# EAGLE schematic relay_board (EAGLE 6.4)
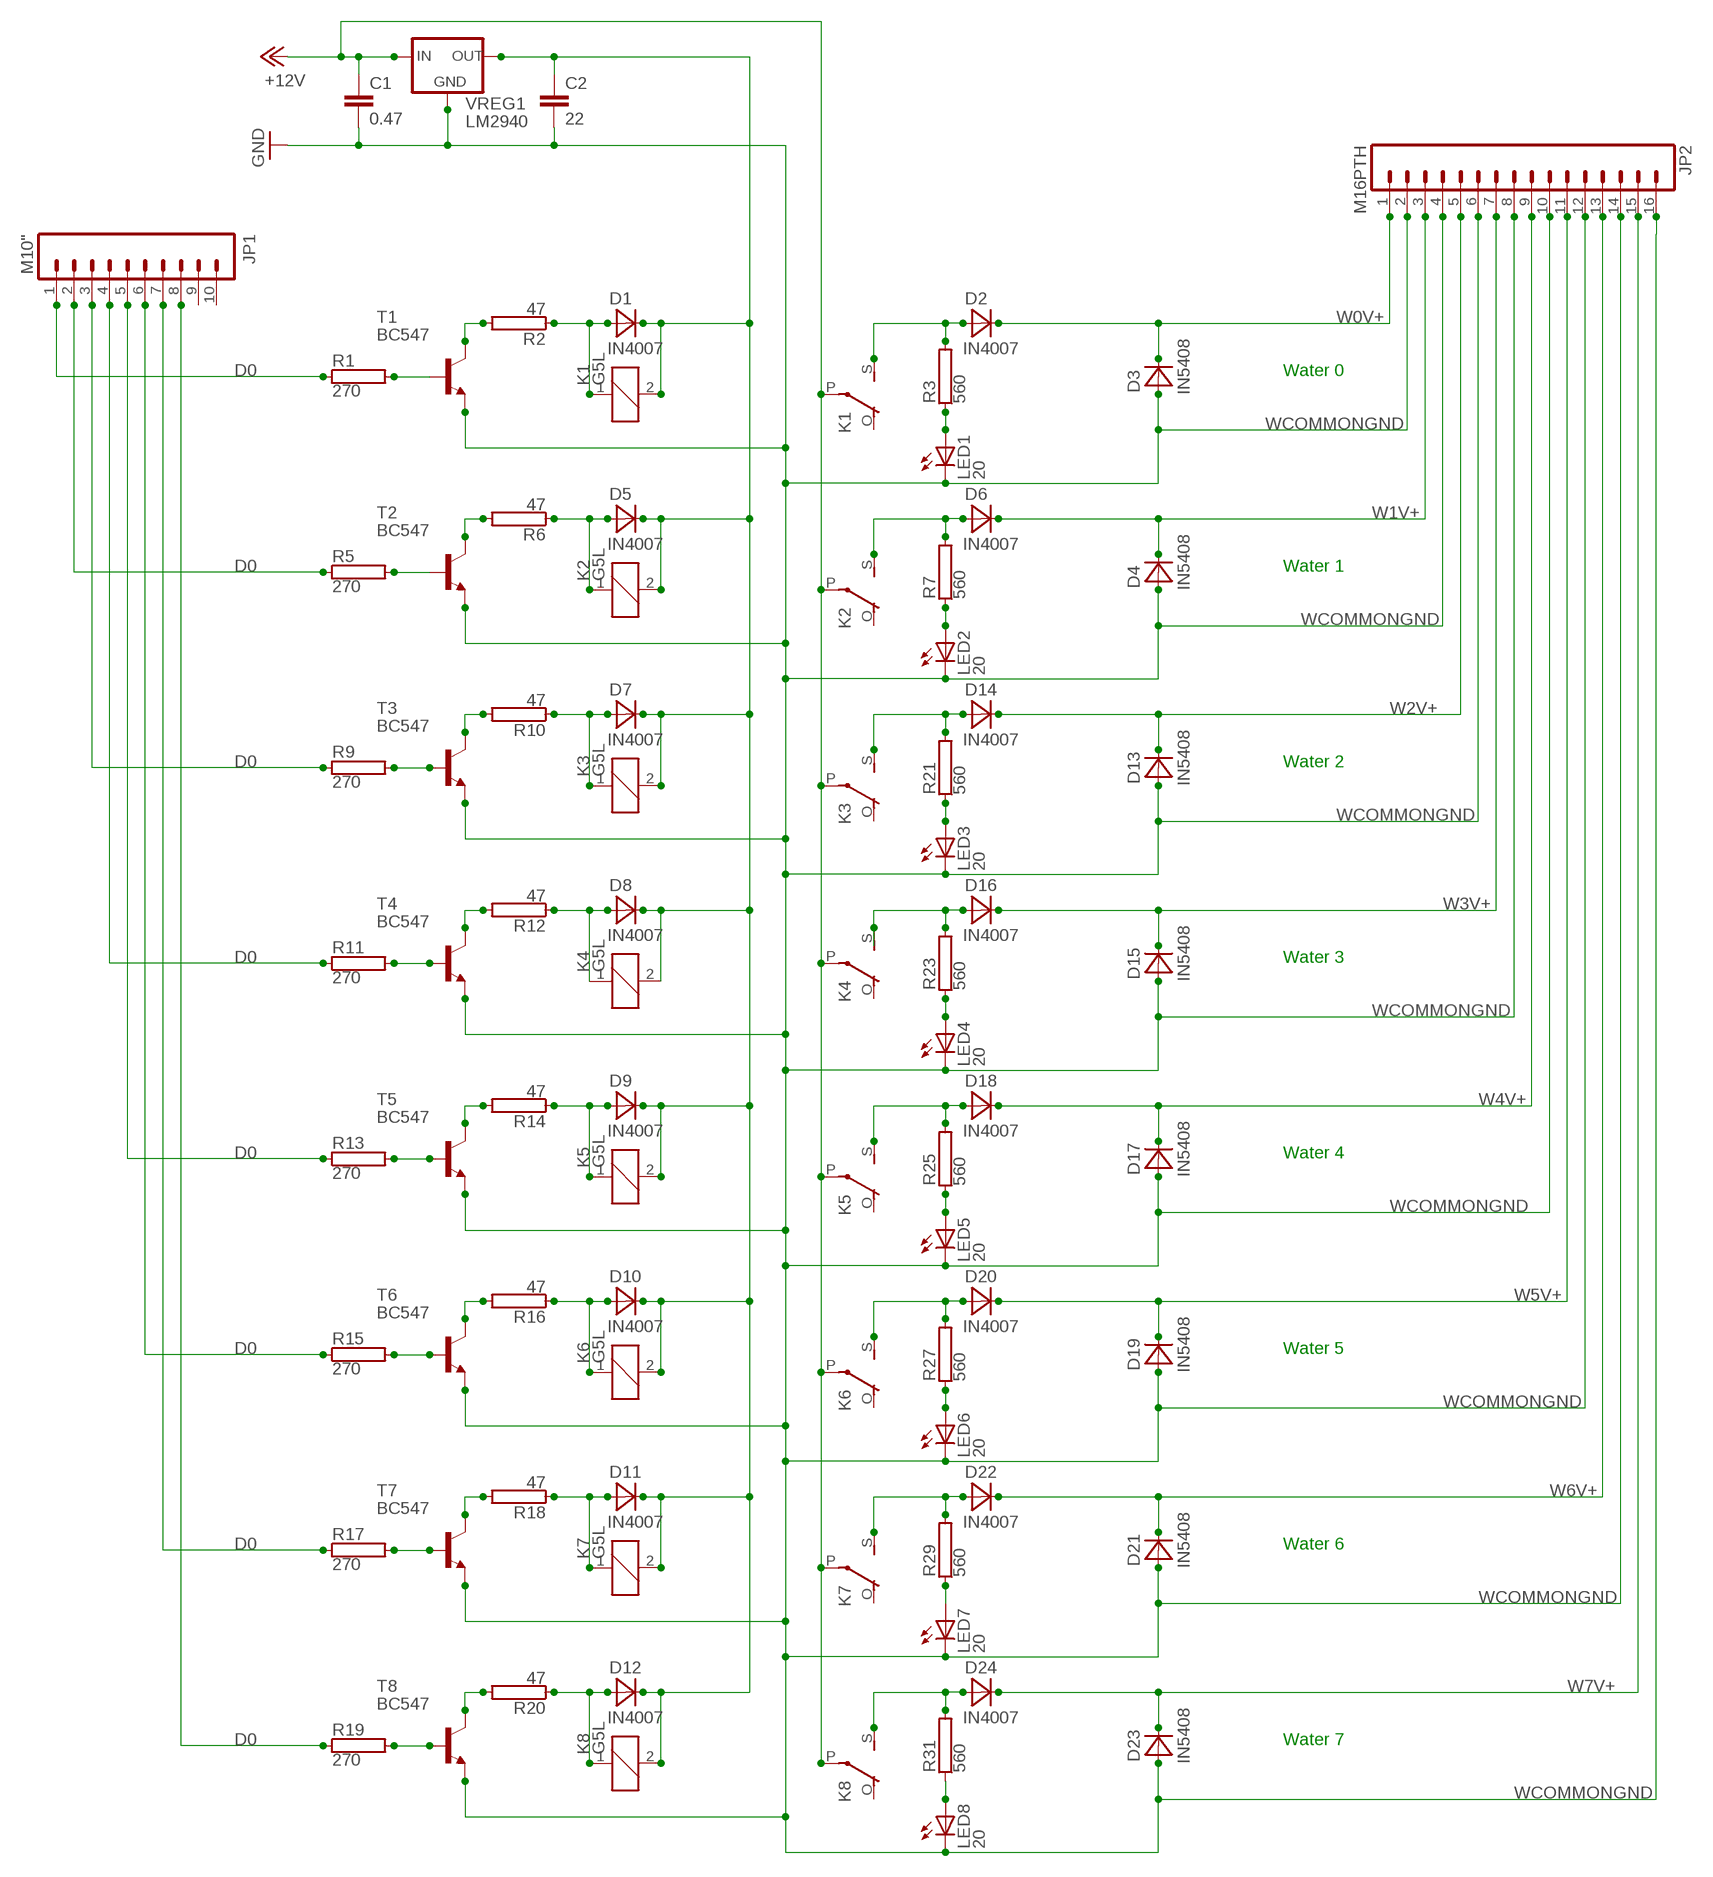
[diagram p0: schematic, sheet 1]

## Parts
C1  0.47  C2,5-3  [C2.5-3]
C2  22  C2,5-3  [C2.5-3]
D1  IN4007  [DO41-10]
D2  IN4007  [DO41-10]
D3  IN5408  [DO41-10]
D4  IN5408  [DO41-10]
D5  IN4007  [DO41-10]
D6  IN4007  [DO41-10]
D7  IN4007  [DO41-10]
D8  IN4007  [DO41-10]
D9  IN4007  [DO41-10]
D10  IN4007  [DO41-10]
D11  IN4007  [DO41-10]
D12  IN4007  [DO41-10]
D13  IN5408  [DO41-10]
D14  IN4007  [DO41-10]
D15  IN5408  [DO41-10]
D16  IN4007  [DO41-10]
D17  IN5408  [DO41-10]
D18  IN4007  [DO41-10]
D19  IN5408  [DO41-10]
D20  IN4007  [DO41-10]
D21  IN5408  [DO41-10]
D22  IN4007  [DO41-10]
D23  IN5408  [DO41-10]
D24  IN4007  [DO41-10]
JP1  M10"  [1X10]
JP2  M16PTH  [1X16]
K1  G5L  [G5LE]
K2  G5L  [G5LE]
K3  G5L  [G5LE]
K4  G5L  [G5LE]
K5  G5L  [G5LE]
K6  G5L  [G5LE]
K7  G5L  [G5LE]
K8  G5L  [G5LE]
LED1  20  LED5MM  [LED5MM]
LED2  20  LED5MM  [LED5MM]
LED3  20  LED5MM  [LED5MM]
LED4  20  LED5MM  [LED5MM]
LED5  20  LED5MM  [LED5MM]
LED6  20  LED5MM  [LED5MM]
LED7  20  LED5MM  [LED5MM]
LED8  20  LED5MM  [LED5MM]
R1  270  RAC01  [AC01]
R2  47  RAC01  [AC01]
R3  560  RAC01  [AC01]
R5  270  RAC01  [AC01]
R6  47  RAC01  [AC01]
R7  560  RAC01  [AC01]
R9  270  RAC01  [AC01]
R10  47  RAC01  [AC01]
R11  270  RAC01  [AC01]
R12  47  RAC01  [AC01]
R13  270  RAC01  [AC01]
R14  47  RAC01  [AC01]
R15  270  RAC01  [AC01]
R16  47  RAC01  [AC01]
R17  270  RAC01  [AC01]
R18  47  RAC01  [AC01]
R19  270  RAC01  [AC01]
R20  47  RAC01  [AC01]
R21  560  RAC01  [AC01]
R23  560  RAC01  [AC01]
R25  560  RAC01  [AC01]
R27  560  RAC01  [AC01]
R29  560  RAC01  [AC01]
R31  560  RAC01  [AC01]
T1  BC547  [TO92]
T2  BC547  [TO92]
T3  BC547  [TO92]
T4  BC547  [TO92]
T5  BC547  [TO92]
T6  BC547  [TO92]
T7  BC547  [TO92]
T8  BC547  [TO92]
VREG1  LM2940  [78XXL]

## Nets
+5VREG: C2.1 D1.C D5.C D7.C D8.C D9.C D10.C D11.C D12.C K1.2 K2.2 K3.2 K4.2 K5.2 K6.2 K7.2 K8.2 VREG1.OUT
+12V: C1.1 K1.P(2:P) K2.P(2:P) K3.P(2:P) K4.P(2:P) K5.P(2:P) K6.P(2:P) K7.P(2:P) K8.P(2:P) VREG1.IN
D0: JP1.1 JP1.2 JP1.3 JP1.4 JP1.5 JP1.6 JP1.7 JP1.8 R1.1 R5.1 R9.1 R11.1 R13.1 R15.1 R17.1 R19.1
N$1: R1.2 T1.2(B)
N$2: R2.2 T1.3(C)
N$3: D1.A K1.1 R2.1
N$5: R9.2 T3.2(B)
N$7: D2.A K1.S(2:S) R3.2
N$8: LED1.A R3.1
N$9: R10.2 T3.3(C)
N$10: R5.2 T2.2(B)
N$11: R6.2 T2.3(C)
N$12: D5.A K2.1 R6.1
N$16: D6.A K2.S(2:S) R7.2
N$17: LED2.A R7.1
N$18: D7.A K3.1 R10.1
N$21: R11.2 T4.2(B)
N$22: R12.2 T4.3(C)
N$23: D8.A K4.1 R12.1
N$26: R13.2 T5.2(B)
N$27: R14.2 T5.3(C)
N$28: D9.A K5.1 R14.1
N$31: R15.2 T6.2(B)
N$32: R16.2 T6.3(C)
N$33: D10.A K6.1 R16.1
N$36: R17.2 T7.2(B)
N$37: R18.2 T7.3(C)
N$38: D11.A K7.1 R18.1
N$41: R19.2 T8.2(B)
N$42: R20.2 T8.3(C)
N$43: D12.A K8.1 R20.1
N$47: D14.A K3.S(2:S) R21.2
N$48: LED3.A R21.1
N$50: D16.A K4.S(2:S) R23.2
N$51: LED4.A R23.1
N$53: D18.A K5.S(2:S) R25.2
N$54: LED5.A R25.1
N$56: D20.A K6.S(2:S) R27.2
N$57: LED6.A R27.1
N$59: D22.A K7.S(2:S) R29.2
N$60: LED7.A R29.1
N$62: D24.A K8.S(2:S) R31.2
N$63: LED8.A R31.1
W0V+: D2.C D3.C JP2.1
W1V+: D4.C D6.C JP2.3
W2V+: D13.C D14.C JP2.5
W3V+: D15.C D16.C JP2.7
W4V+: D17.C D18.C JP2.9
W5V+: D19.C D20.C JP2.11
W6V+: D21.C D22.C JP2.13
W7V+: D23.C D24.C JP2.15
WCOMMONGND: C1.2 C2.2 D3.A D4.A D13.A D15.A D17.A D19.A D21.A D23.A JP2.2 JP2.4 JP2.6 JP2.8 JP2.10 JP2.12 JP2.14 JP2.16 LED1.K(C) LED2.K(C) LED3.K(C) LED4.K(C) LED5.K(C) LED6.K(C) LED7.K(C) LED8.K(C) T1.1(E) T2.1(E) T3.1(E) T4.1(E) T5.1(E) T6.1(E) T7.1(E) T8.1(E) VREG1.GND ; supply symbol labelled GND
Unconnected: JP1.9 JP1.10 K1.O(2:O) K2.O(2:O) K3.O(2:O) K4.O(2:O) K5.O(2:O) K6.O(2:O) K7.O(2:O) K8.O(2:O)

## Notes on the sheet
- Water 0
- Water 1
- Water 2
- Water 3
- Water 4
- Water 5
- Water 6
- Water 7

## Library data of the parts
C1 C2 = capacitor-wima:C: CAPACITOR naming: grid - package width
D1 D2 D5-D12 D14 D16 D18 D20 D22 D24 = pers:IN4007: IN4007 Diode
D3 D4 D13 D15 D17 D19 D21 D23 = pers:IN5408: IN5408 Diode
JP1 = SparkFun-Connectors:M10: Header 10 Standard 10-pin 0.1" header. Use with straight break away headers (SKU : PRT-00116), right angle break away headers (PRT-00553), swiss pins (PRT-00743), machine pins (PRT-00117), and female headers (PRT-00115).
JP2 = SparkFun-Connectors:M16: 1x16 .1" header
K1-K8 = relay:G5L: RELAY 1 x switch, 10 A/120 V AC, 8 A/30 V ADC, Omron; OC_FARNELL: unknown; OC_NEWARK: unknown
LED1-LED8 = led:LED: LED OSRAM: - CHIPLED LG R971, LG N971, LY N971, LG Q971, LY Q971, LO R971, LY R971 LH N974, LH R974 LS Q976, LO Q976, LY Q976 LO Q996 - Hyper CHIPLED LW Q18S LB Q993, LB Q99A, LB R99A - SideLED LS A670, LO A670, LY A670, LG A670, LP A670 LB A673, LV A673, LT A673, LW A673 LH A674 LY A675 LS A676, LA A676, LO A676, LY A676, LW A676 LS A679, LY A679, LG A679 - Hyper Micro SIDELED® LS Y876, LA Y876, LO Y876, LY Y876 LT Y87S - SmartLED LW L88C, LW L88S LB L89C, LB L89S, LG L890 LS L89K, LO L89K, LY L89K LS L896, LA L896, LO L896, LY L896 - TOPLED LS T670, LO T670, LY T670, LG T670, LP T670 LSG T670, LSP T670, LSY T670, LOP T670, LYG T670 LG T671, LOG T671, LSG T671 LB T673, LV T673, LT T673, LW T673 LH T674 LS T676, LA T676, LO T676, LY T676, LB T676, LH T676, LSB T676, LW T676 LB T67C, LV T67C, LT T67C, LS T67K, LO T67K, LY T67K, LW E67C LS E67B, LA E67B, LO E67B, LY E67B, LB E67C, LV E67C, LT E67C LW T67C LS T679, LY T679, LG T679 LS T770, LO T770, LY T770, LG T770, LP T770 LB T773, LV T773, LT T773, LW T773 LH T774 LS E675, LA E675, LY E675, LS T675 LS T776, LA T776, LO T776, LY T776, LB T776 LHGB T686 LT T68C, LB T68C - Hyper Mini TOPLED® LB M676 - Mini TOPLED Santana® LG M470 LS M47K, LO M47K, LY M47K Source: http://www.osram.convergy.de LUXEON: - LUMILED® LXK2-PW12-R00, LXK2-PW12-S00, LXK2-PW14-U00, LXK2-PW14-V00 LXK2-PM12-R00, LXK2-PM12-S00, LXK2-PM14-U00 LXK2-PE12-Q00, LXK2-PE12-R00, LXK2-PE12-S00, LXK2-PE14-T00, LXK2-PE14-U00 LXK2-PB12-K00, LXK2-PB12-L00, LXK2-PB12-M00, LXK2-PB14-N00, LXK2-PB14-P00, LXK2-PB14-Q00 LXK2-PR12-L00, LXK2-PR12-M00, LXK2-PR14-Q00, LXK2-PR14-R00 LXK2-PD12-Q00, LXK2-PD12-R00, LXK2-PD12-S00 LXK2-PH12-R00, LXK2-PH12-S00 LXK2-PL12-P00, LXK2-PL12-Q00, LXK2-PL12-R00 Source: www.luxeon.com KINGBRIGHT: KA-3528ASYC Source: www.kingbright.com
R1-R3 R5-R7 R9-R21 R23 R25 R27 R29 R31 = resistor-power:R: Power Resitor; OC_FARNELL: unknown; OC_NEWARK: unknown
T1-T8 = transistor:BC547: NPN TRANSISTOR
VREG1 = pers:LM2940